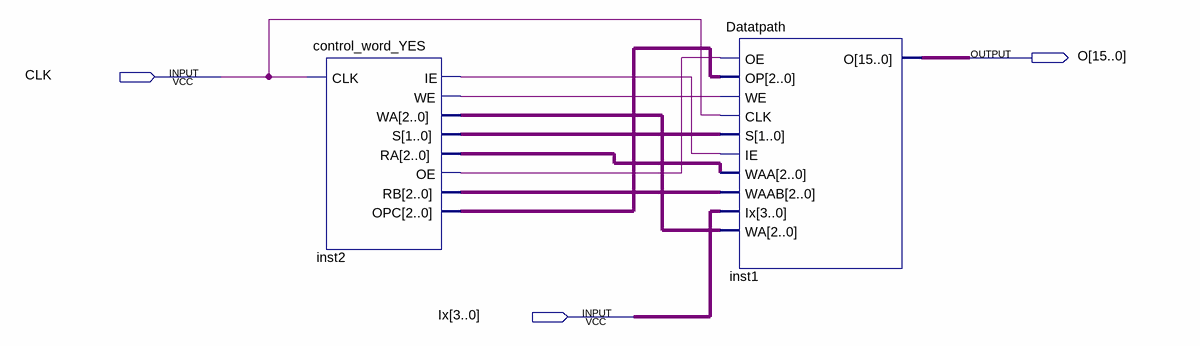
[diagram p0: schematic sheet]
// Quartus schematic processor.bdf as structural Verilog: 2 symbols, 3 pins
module processor (
  input  CLK,
  input  [3:0] Ix,
  output [15:0] O
);

  wire inst2_ie, inst2_oe, inst2_we;
  wire [1:0] inst2_s;
  wire [2:0] inst2_opc, inst2_ra, inst2_rb, inst2_wa;

  control_word_YES inst2 (
    .CLK(CLK), .IE(inst2_ie), .WE(inst2_we), .WA(inst2_wa), .S(inst2_s), .RA(inst2_ra), .OE(inst2_oe),
    .RB(inst2_rb), .OPC(inst2_opc));
  Datatpath inst1 (
    .OE(inst2_oe), .OP(inst2_opc), .WE(inst2_we), .CLK(CLK), .S(inst2_s), .IE(inst2_ie), .WAA(inst2_ra),
    .WAAB(inst2_rb), .Ix(Ix), .WA(inst2_wa), .O(O));
endmodule
